# EAGLE schematic Nostromo Gamepad (EAGLE 6.4)
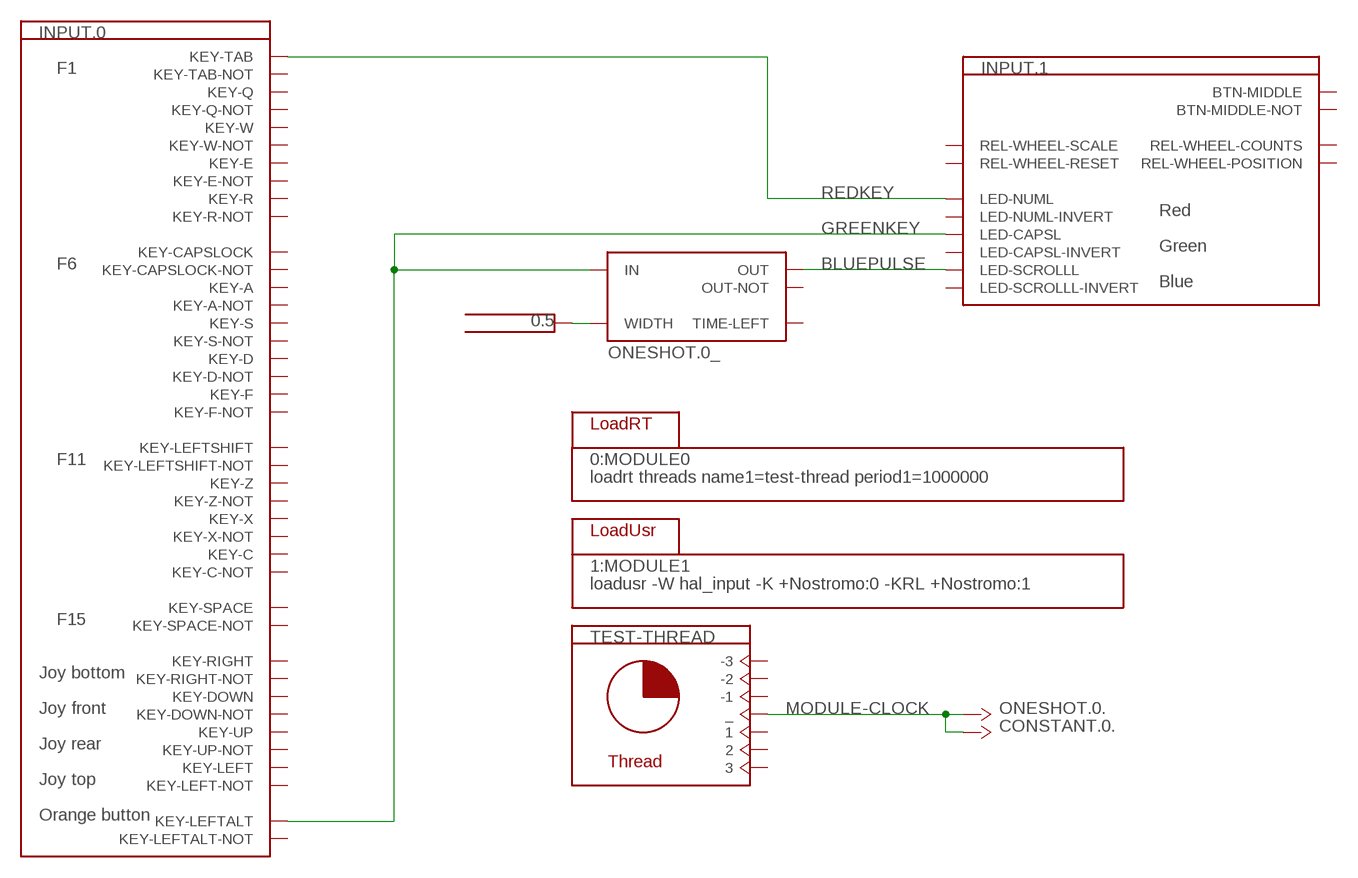
[diagram p0: schematic, sheet 1]

## Parts
0:MODULE0  loadrt threads name1=test-thread period1=1000000  LOADRT  [DUMMY]
CONSTANT.0  0.5  CONSTANT  [DUMMY]
INPUT.0  NOSTROMO-N52-KEYS  [DUMMY]
INPUT.1  NOSTROMO-N52-WHEEL-LEDS  [DUMMY]
ONESHOT.0  ONESHOT  [DUMMY]
TEST-THREAD  THREAD  [DUMMY]

## Nets
BLUEPULSE: INPUT.1.P$7(LED-SCROLLL) ONESHOT.0.P$6(_:OUT)
DURATION: CONSTANT.0.P$2 ONESHOT.0.P$9(_:WIDTH)
GREENKEY: INPUT.0.P$18(KEY-LEFTALT) INPUT.1.P$3(LED-CAPSL) ONESHOT.0.P$5(_:IN)
MODULE-CLOCK: CONSTANT.0.P$1 ONESHOT.0.P$1(.:PIN_THREAD) TEST-THREAD.P$7(_)
REDKEY: INPUT.0.P$32(KEY-TAB) INPUT.1.P$5(LED-NUML)
Unconnected: INPUT.0.P$2(KEY-A) INPUT.0.P$3(KEY-A-NOT) INPUT.0.P$4(KEY-C) INPUT.0.P$5(KEY-C-NOT) INPUT.0.P$6(KEY-CAPSLOCK) INPUT.0.P$7(KEY-CAPSLOCK-NOT) INPUT.0.P$8(KEY-D) INPUT.0.P$9(KEY-D-NOT) INPUT.0.P$10(KEY-DOWN) INPUT.0.P$11(KEY-DOWN-NOT) INPUT.0.P$12(KEY-E) INPUT.0.P$13(KEY-E-NOT) INPUT.0.P$14(KEY-F) INPUT.0.P$15(KEY-F-NOT) INPUT.0.P$16(KEY-LEFT) INPUT.0.P$17(KEY-LEFT-NOT) INPUT.0.P$19(KEY-LEFTALT-NOT) INPUT.0.P$20(KEY-LEFTSHIFT) INPUT.0.P$21(KEY-LEFTSHIFT-NOT) INPUT.0.P$22(KEY-Q) INPUT.0.P$23(KEY-Q-NOT) INPUT.0.P$24(KEY-R) INPUT.0.P$25(KEY-R-NOT) INPUT.0.P$26(KEY-RIGHT) INPUT.0.P$27(KEY-RIGHT-NOT) INPUT.0.P$28(KEY-S) INPUT.0.P$29(KEY-S-NOT) INPUT.0.P$30(KEY-SPACE) INPUT.0.P$31(KEY-SPACE-NOT) INPUT.0.P$33(KEY-TAB-NOT) INPUT.0.P$34(KEY-UP) INPUT.0.P$35(KEY-UP-NOT) INPUT.0.P$36(KEY-W) INPUT.0.P$37(KEY-W-NOT) INPUT.0.P$38(KEY-X) INPUT.0.P$39(KEY-X-NOT) INPUT.0.P$40(KEY-Z) INPUT.0.P$41(KEY-Z-NOT) INPUT.1.P$1(BTN-MIDDLE) INPUT.1.P$2(BTN-MIDDLE-NOT) INPUT.1.P$4(LED-CAPSL-INVERT) INPUT.1.P$6(LED-NUML-INVERT) INPUT.1.P$8(LED-SCROLLL-INVERT) INPUT.1.P$9(REL-WHEEL-COUNTS) INPUT.1.P$10(REL-WHEEL-POSITION) INPUT.1.P$11(REL-WHEEL-RESET) INPUT.1.P$12(REL-WHEEL-SCALE) ONESHOT.0.P$2(.FALLING:PIN_PARAMETER) ONESHOT.0.P$3(.RETRIGGERABLE:PIN_PARAMETER) ONESHOT.0.P$4(.RISING:PIN_PARAMETER) ONESHOT.0.P$7(_:OUT-NOT) ONESHOT.0.P$8(_:TIME-LEFT) TEST-THREAD.P$1(-1) TEST-THREAD.P$2(-2) TEST-THREAD.P$3(-3) TEST-THREAD.P$4 TEST-THREAD.P$5 TEST-THREAD.P$6

## Library data of the parts
0:MODULE0 = hal-config:LOADRT: HAL LoadRT Loads realtime module Part Name field = <index>:MODULEn Set <index> to control load sequence MODULEn triggers Eagle-to-HAL script Part Value field = HAL module command line: loadrt threads name1=test-thread period1=1000000
CONSTANT.0 = hal-config:CONSTANT: Emit constant value Rename first device: constant.1 -> constant.0
INPUT.0 = hal-config:NOSTROMO-N52-KEYS: Nostromo N52 Controller Keypad, joypad, button inputs Use loadusr -W hal_input -K +Nostromo:0
INPUT.1 = hal-config:NOSTROMO-N52-WHEEL-LEDS: Nostromo N52 Controller Scroll wheel and LEDs Use loadusr -W hal_input -KRL +Nostromo:1
ONESHOT.0 = hal-config:ONESHOT
TEST-THREAD = hal-config:THREAD